# Altium schematic sheet 04-1 m8 power.SchDoc
size A3; SheetNumber: 5; SheetTotal: 16
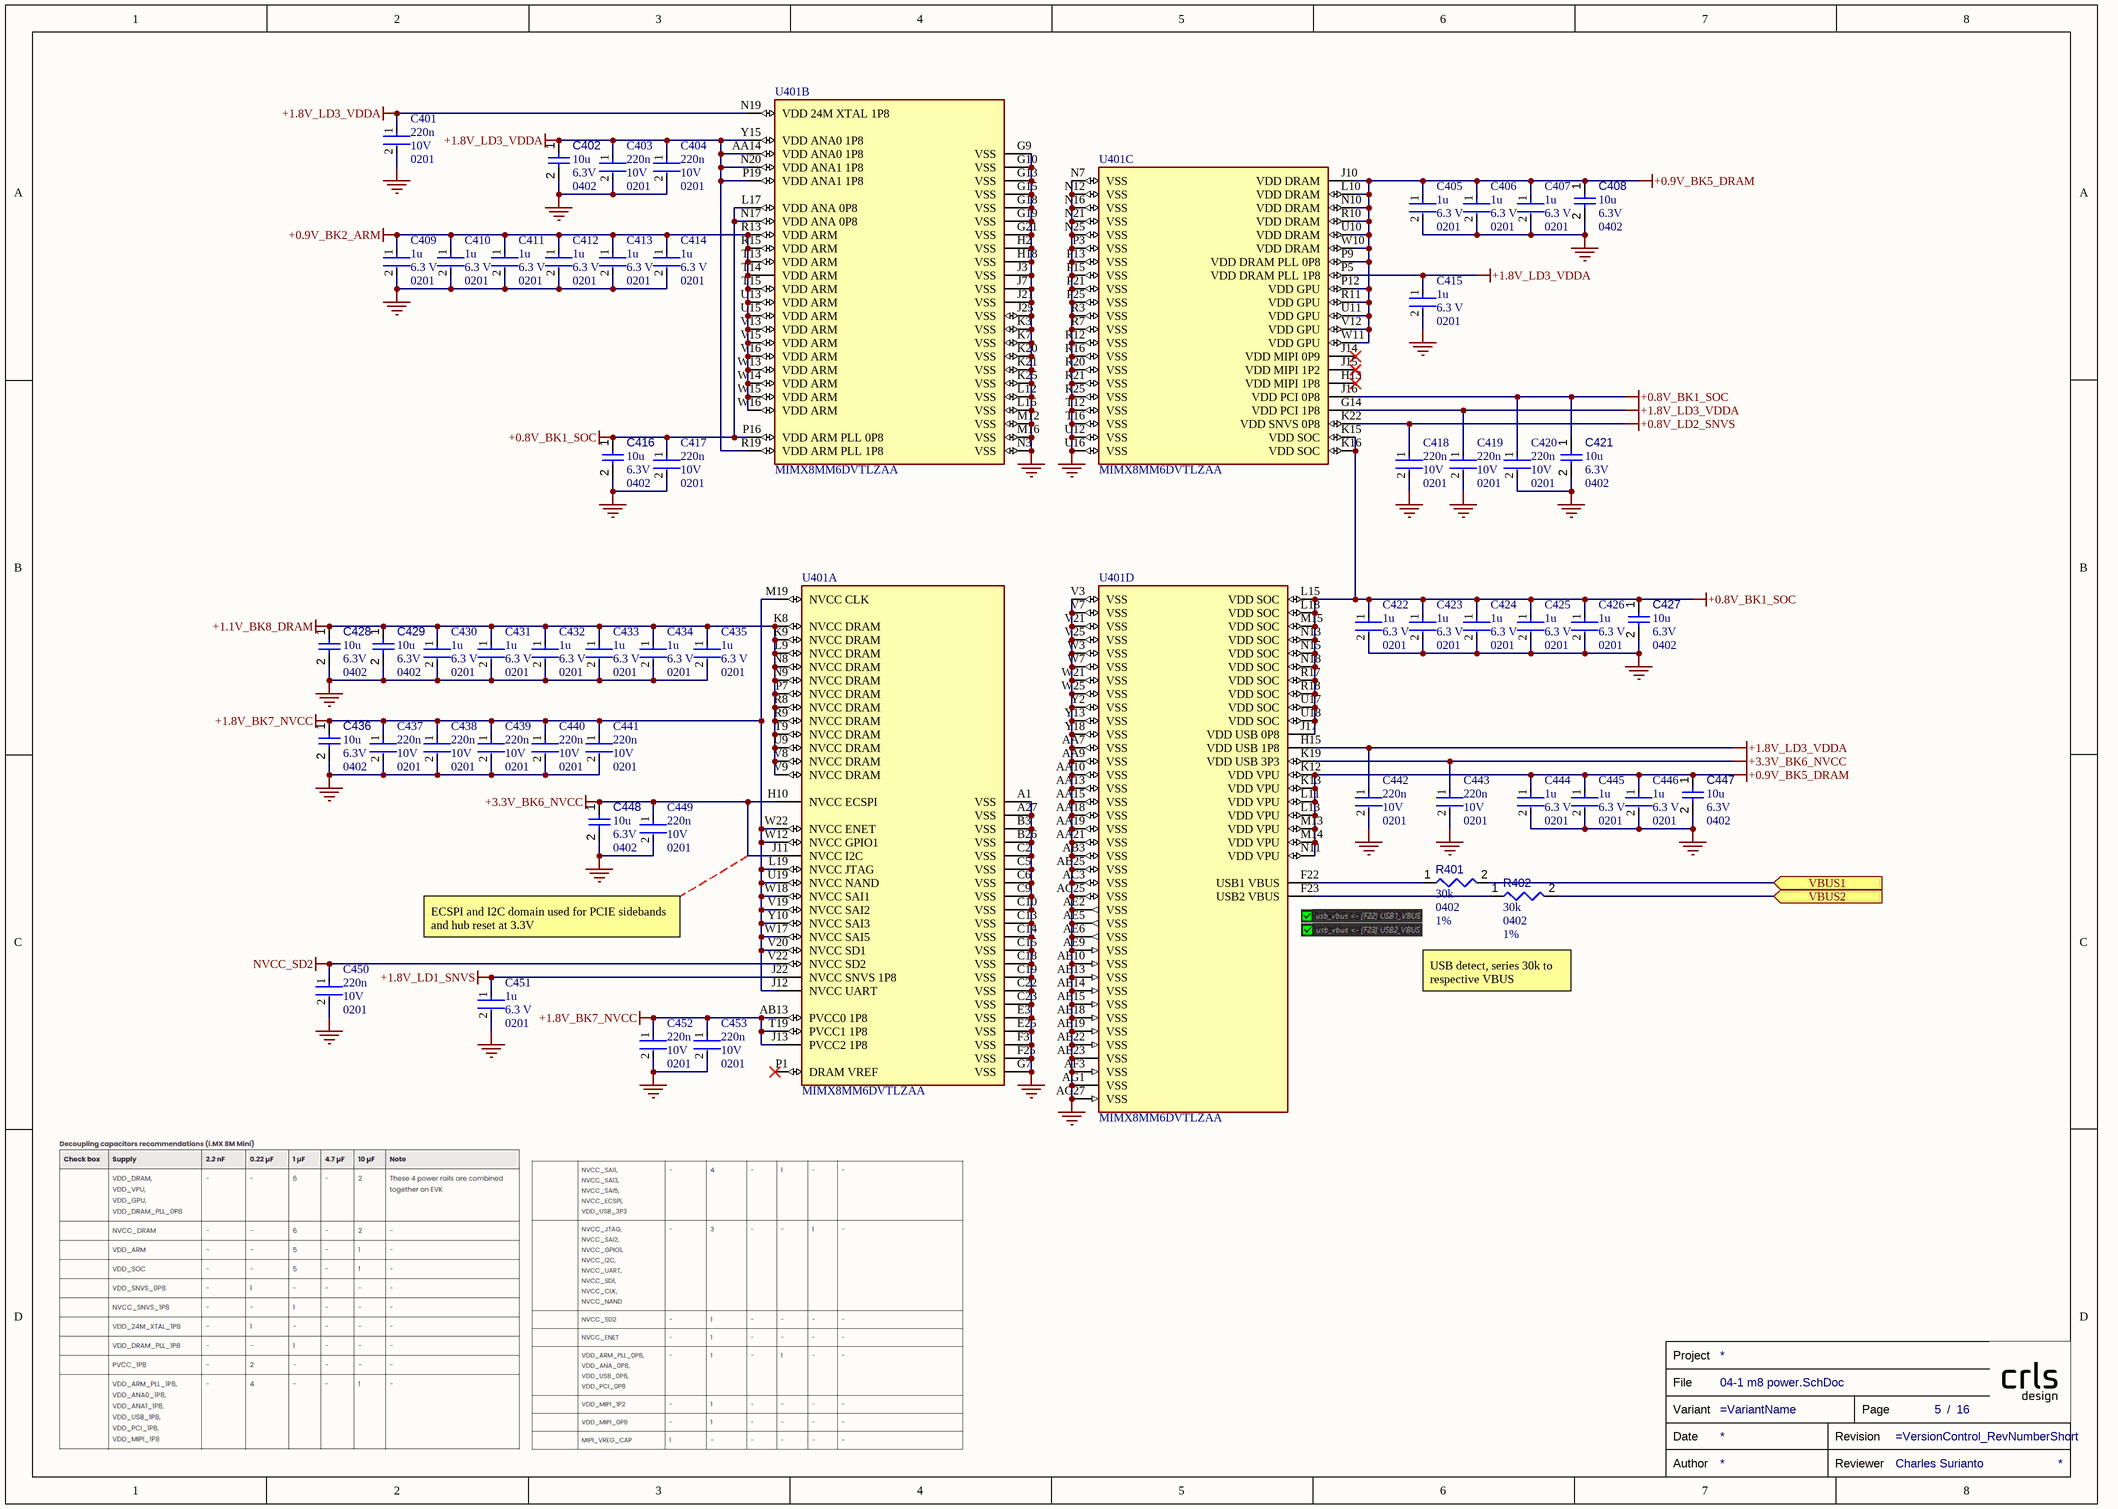
[diagram p0: 04-1 m8 power.SchDoc]

## Parts
C401  Case/Package: 0201  Voltage: 10V  Capacitance: 220n  [FP-0201-L_0_6_0_03-W_0_3-MFG]  (hidden comment: LMK063BJ224MP-F)
C402  value 10u  Case/Package: 0402  Voltage Rating: 6.3V  [CAPC0402(1005)60_L]  (hidden comment: Capacitors,0402,10u,6.3V)
C403  Case/Package: 0201  Voltage: 10V  Capacitance: 220n  [FP-0201-L_0_6_0_03-W_0_3-MFG]  (hidden comment: LMK063BJ224MP-F)
C404  Case/Package: 0201  Voltage: 10V  Capacitance: 220n  [FP-0201-L_0_6_0_03-W_0_3-MFG]  (hidden comment: LMK063BJ224MP-F)
C405  Package: 0201  Capacitance: 1u  Voltage Rating: 6.3 V  [FP-CC0201-BA-MFG]  (hidden comment: CC0201MRX5R5BB105)
C406  Package: 0201  Capacitance: 1u  Voltage Rating: 6.3 V  [FP-CC0201-BA-MFG]  (hidden comment: CC0201MRX5R5BB105)
C407  Package: 0201  Capacitance: 1u  Voltage Rating: 6.3 V  [FP-CC0201-BA-MFG]  (hidden comment: CC0201MRX5R5BB105)
C408  value 10u  Case/Package: 0402  Voltage Rating: 6.3V  [CAPC0402(1005)60_L]  (hidden comment: Capacitors,0402,10u,6.3V)
C409  Package: 0201  Capacitance: 1u  Voltage Rating: 6.3 V  [FP-CC0201-BA-MFG]  (hidden comment: CC0201MRX5R5BB105)
C410  Package: 0201  Capacitance: 1u  Voltage Rating: 6.3 V  [FP-CC0201-BA-MFG]  (hidden comment: CC0201MRX5R5BB105)
C411  Package: 0201  Capacitance: 1u  Voltage Rating: 6.3 V  [FP-CC0201-BA-MFG]  (hidden comment: CC0201MRX5R5BB105)
C412  Package: 0201  Capacitance: 1u  Voltage Rating: 6.3 V  [FP-CC0201-BA-MFG]  (hidden comment: CC0201MRX5R5BB105)
C413  Package: 0201  Capacitance: 1u  Voltage Rating: 6.3 V  [FP-CC0201-BA-MFG]  (hidden comment: CC0201MRX5R5BB105)
C414  Package: 0201  Capacitance: 1u  Voltage Rating: 6.3 V  [FP-CC0201-BA-MFG]  (hidden comment: CC0201MRX5R5BB105)
C415  Package: 0201  Capacitance: 1u  Voltage Rating: 6.3 V  [FP-CC0201-BA-MFG]  (hidden comment: CC0201MRX5R5BB105)
C416  value 10u  Case/Package: 0402  Voltage Rating: 6.3V  [CAPC0402(1005)60_L]  (hidden comment: Capacitors,0402,10u,6.3V)
C417  Case/Package: 0201  Voltage: 10V  Capacitance: 220n  [FP-0201-L_0_6_0_03-W_0_3-MFG]  (hidden comment: LMK063BJ224MP-F)
C418  Case/Package: 0201  Voltage: 10V  Capacitance: 220n  [FP-0201-L_0_6_0_03-W_0_3-MFG]  (hidden comment: LMK063BJ224MP-F)
C419  Case/Package: 0201  Voltage: 10V  Capacitance: 220n  [FP-0201-L_0_6_0_03-W_0_3-MFG]  (hidden comment: LMK063BJ224MP-F)
C420  Case/Package: 0201  Voltage: 10V  Capacitance: 220n  [FP-0201-L_0_6_0_03-W_0_3-MFG]  (hidden comment: LMK063BJ224MP-F)
C421  value 10u  Case/Package: 0402  Voltage Rating: 6.3V  [CAPC0402(1005)60_L]  (hidden comment: Capacitors,0402,10u,6.3V)
C422  Package: 0201  Capacitance: 1u  Voltage Rating: 6.3 V  [FP-CC0201-BA-MFG]  (hidden comment: CC0201MRX5R5BB105)
C423  Package: 0201  Capacitance: 1u  Voltage Rating: 6.3 V  [FP-CC0201-BA-MFG]  (hidden comment: CC0201MRX5R5BB105)
C424  Package: 0201  Capacitance: 1u  Voltage Rating: 6.3 V  [FP-CC0201-BA-MFG]  (hidden comment: CC0201MRX5R5BB105)
C425  Package: 0201  Capacitance: 1u  Voltage Rating: 6.3 V  [FP-CC0201-BA-MFG]  (hidden comment: CC0201MRX5R5BB105)
C426  Package: 0201  Capacitance: 1u  Voltage Rating: 6.3 V  [FP-CC0201-BA-MFG]  (hidden comment: CC0201MRX5R5BB105)
C427  value 10u  Case/Package: 0402  Voltage Rating: 6.3V  [CAPC0402(1005)60_L]  (hidden comment: Capacitors,0402,10u,6.3V)
C428  value 10u  Case/Package: 0402  Voltage Rating: 6.3V  [CAPC0402(1005)60_L]  (hidden comment: Capacitors,0402,10u,6.3V)
C429  value 10u  Case/Package: 0402  Voltage Rating: 6.3V  [CAPC0402(1005)60_L]  (hidden comment: Capacitors,0402,10u,6.3V)
C430  Package: 0201  Capacitance: 1u  Voltage Rating: 6.3 V  [FP-CC0201-BA-MFG]  (hidden comment: CC0201MRX5R5BB105)
C431  Package: 0201  Capacitance: 1u  Voltage Rating: 6.3 V  [FP-CC0201-BA-MFG]  (hidden comment: CC0201MRX5R5BB105)
C432  Package: 0201  Capacitance: 1u  Voltage Rating: 6.3 V  [FP-CC0201-BA-MFG]  (hidden comment: CC0201MRX5R5BB105)
C433  Package: 0201  Capacitance: 1u  Voltage Rating: 6.3 V  [FP-CC0201-BA-MFG]  (hidden comment: CC0201MRX5R5BB105)
C434  Package: 0201  Capacitance: 1u  Voltage Rating: 6.3 V  [FP-CC0201-BA-MFG]  (hidden comment: CC0201MRX5R5BB105)
C435  Package: 0201  Capacitance: 1u  Voltage Rating: 6.3 V  [FP-CC0201-BA-MFG]  (hidden comment: CC0201MRX5R5BB105)
C436  value 10u  Case/Package: 0402  Voltage Rating: 6.3V  [CAPC0402(1005)60_L]  (hidden comment: Capacitors,0402,10u,6.3V)
C437  Case/Package: 0201  Voltage: 10V  Capacitance: 220n  [FP-0201-L_0_6_0_03-W_0_3-MFG]  (hidden comment: LMK063BJ224MP-F)
C438  Case/Package: 0201  Voltage: 10V  Capacitance: 220n  [FP-0201-L_0_6_0_03-W_0_3-MFG]  (hidden comment: LMK063BJ224MP-F)
C439  Case/Package: 0201  Voltage: 10V  Capacitance: 220n  [FP-0201-L_0_6_0_03-W_0_3-MFG]  (hidden comment: LMK063BJ224MP-F)
C440  Case/Package: 0201  Voltage: 10V  Capacitance: 220n  [FP-0201-L_0_6_0_03-W_0_3-MFG]  (hidden comment: LMK063BJ224MP-F)
C441  Case/Package: 0201  Voltage: 10V  Capacitance: 220n  [FP-0201-L_0_6_0_03-W_0_3-MFG]  (hidden comment: LMK063BJ224MP-F)
C442  Case/Package: 0201  Voltage: 10V  Capacitance: 220n  [FP-0201-L_0_6_0_03-W_0_3-MFG]  (hidden comment: LMK063BJ224MP-F)
C443  Case/Package: 0201  Voltage: 10V  Capacitance: 220n  [FP-0201-L_0_6_0_03-W_0_3-MFG]  (hidden comment: LMK063BJ224MP-F)
C444  Package: 0201  Capacitance: 1u  Voltage Rating: 6.3 V  [FP-CC0201-BA-MFG]  (hidden comment: CC0201MRX5R5BB105)
C445  Package: 0201  Capacitance: 1u  Voltage Rating: 6.3 V  [FP-CC0201-BA-MFG]  (hidden comment: CC0201MRX5R5BB105)
C446  Package: 0201  Capacitance: 1u  Voltage Rating: 6.3 V  [FP-CC0201-BA-MFG]  (hidden comment: CC0201MRX5R5BB105)
C447  value 10u  Case/Package: 0402  Voltage Rating: 6.3V  [CAPC0402(1005)60_L]  (hidden comment: Capacitors,0402,10u,6.3V)
C448  value 10u  Case/Package: 0402  Voltage Rating: 6.3V  [CAPC0402(1005)60_L]  (hidden comment: Capacitors,0402,10u,6.3V)
C449  Case/Package: 0201  Voltage: 10V  Capacitance: 220n  [FP-0201-L_0_6_0_03-W_0_3-MFG]  (hidden comment: LMK063BJ224MP-F)
C450  Case/Package: 0201  Voltage: 10V  Capacitance: 220n  [FP-0201-L_0_6_0_03-W_0_3-MFG]  (hidden comment: LMK063BJ224MP-F)
C451  Package: 0201  Capacitance: 1u  Voltage Rating: 6.3 V  [FP-CC0201-BA-MFG]  (hidden comment: CC0201MRX5R5BB105)
C452  Case/Package: 0201  Voltage: 10V  Capacitance: 220n  [FP-0201-L_0_6_0_03-W_0_3-MFG]  (hidden comment: LMK063BJ224MP-F)
C453  Case/Package: 0201  Voltage: 10V  Capacitance: 220n  [FP-0201-L_0_6_0_03-W_0_3-MFG]  (hidden comment: LMK063BJ224MP-F)
R401  value 30k  Case/Package: 0402  Tolerance: 1%  [RESC0402(1005)_L]  (hidden comment: Resistors,0402,1%,30k)
R402  value 30k  Case/Package: 0402  Tolerance: 1%  [RESC0402(1005)_L]  (hidden comment: Resistors,0402,1%,30k)
TB?  Reviewer: Charles Surianto  (hidden comment: TITLE_BLOCK)  (graphical)
U401  MIMX8MM6DVTLZAA  [FP-SOT1967-2-IPC_A]  (parts A,B,C,D of 11)

## Ports
VBUS1 (in), VBUS2 (in)

## Nets
+0.8V_BK1_SOC: C416.1 C417.1 C420.1 C421.1 C422.1 C423.1 C424.1 C425.1 C426.1 C427.1 U401.J16(VDD_PCI_0P8) U401.J17(VDD_USB_0P8) U401.K15(VDD_SOC) U401.K16(VDD_SOC) U401.L15(VDD_SOC) U401.L17(VDD_ANA_0P8) U401.L18(VDD_SOC) U401.M15(VDD_SOC) U401.N13(VDD_SOC) U401.N15(VDD_SOC) U401.N17(VDD_ANA_0P8) U401.N18(VDD_SOC) U401.P16(VDD_ARM_PLL_0P8) U401.R17(VDD_SOC) U401.R18(VDD_SOC) U401.U17(VDD_SOC) U401.U18(VDD_SOC)
+0.8V_LD2_SNVS: C418.1 U401.K22(VDD_SNVS_0P8)
+0.9V_BK2_ARM: C409.1 C410.1 C411.1 C412.1 C413.1 C414.1 U401.R13(VDD_ARM) U401.R15(VDD_ARM) U401.T13(VDD_ARM) U401.T14(VDD_ARM) U401.T15(VDD_ARM) U401.U13(VDD_ARM) U401.U15(VDD_ARM) U401.V13(VDD_ARM) U401.V15(VDD_ARM) U401.V16(VDD_ARM) U401.W13(VDD_ARM) U401.W14(VDD_ARM) U401.W15(VDD_ARM) U401.W16(VDD_ARM)
+0.9V_BK5_DRAM: C405.1 C406.1 C407.1 C408.1 C444.1 C445.1 C446.1 C447.1 U401.J10(VDD_DRAM) U401.K12(VDD_VPU) U401.K13(VDD_VPU) U401.L10(VDD_DRAM) U401.L11(VDD_VPU) U401.L13(VDD_VPU) U401.M13(VDD_VPU) U401.M14(VDD_VPU) U401.N10(VDD_DRAM) U401.N11(VDD_VPU) U401.P9(VDD_DRAM_PLL_0P8) U401.P12(VDD_GPU) U401.R10(VDD_DRAM) U401.R11(VDD_GPU) U401.U10(VDD_DRAM) U401.U11(VDD_GPU) U401.V12(VDD_GPU) U401.W10(VDD_DRAM) U401.W11(VDD_GPU)
+1.1V_BK8_DRAM: C428.1 C429.1 C430.1 C431.1 C432.1 C433.1 C434.1 C435.1 U401.K8(NVCC_DRAM) U401.K9(NVCC_DRAM) U401.L9(NVCC_DRAM) U401.N8(NVCC_DRAM) U401.N9(NVCC_DRAM) U401.P7(NVCC_DRAM) U401.R8(NVCC_DRAM) U401.R9(NVCC_DRAM) U401.T9(NVCC_DRAM) U401.U9(NVCC_DRAM) U401.V8(NVCC_DRAM) U401.V9(NVCC_DRAM)
+1.8V_BK7_NVCC: C436.1 C437.1 C438.1 C439.1 C440.1 C441.1 C452.1 C453.1 U401.AB13(PVCC0_1P8) U401.J12(NVCC_UART) U401.J13(PVCC2_1P8) U401.L19(NVCC_JTAG) U401.M19(NVCC_CLK) U401.T19(PVCC1_1P8) U401.U19(NVCC_NAND) U401.V19(NVCC_SAI2) U401.V20(NVCC_SD1) U401.W12(NVCC_GPIO1) U401.W17(NVCC_SAI5) U401.W18(NVCC_SAI1) U401.W22(NVCC_ENET) U401.Y10(NVCC_SAI3)
+1.8V_LD1_SNVS: C451.1 U401.J22(NVCC_SNVS_1P8)
+1.8V_LD3_VDDA: C401.1 C402.1 C403.1 C404.1 C415.1 C419.1 C442.1 U401.AA14(VDD_ANA0_1P8) U401.G14(VDD_PCI_1P8) U401.H15(VDD_USB_1P8) U401.N19(VDD_24M_XTAL_1P8) U401.N20(VDD_ANA1_1P8) U401.P5(VDD_DRAM_PLL_1P8) U401.P19(VDD_ANA1_1P8) U401.R19(VDD_ARM_PLL_1P8) U401.Y15(VDD_ANA0_1P8)
+3.3V_BK6_NVCC: C443.1 C448.1 C449.1 U401.H10(NVCC_ECSPI) U401.J11(NVCC_I2C) U401.K19(VDD_USB_3P3)
GND: C401.2 C402.2 C403.2 C404.2 C405.2 C406.2 C407.2 C408.2 C409.2 C410.2 C411.2 C412.2 C413.2 C414.2 C415.2 C416.2 C417.2 C418.2 C419.2 C420.2 C421.2 C422.2 C423.2 C424.2 C425.2 C426.2 C427.2 C428.2 C429.2 C430.2 C431.2 C432.2 C433.2 C434.2 C435.2 C436.2 C437.2 C438.2 C439.2 C440.2 C441.2 C442.2 C443.2 C444.2 C445.2 C446.2 C447.2 C448.2 C449.2 C450.2 C451.2 C452.2 C453.2 U401.A1(VSS) U401.A27(VSS) U401.AA7(VSS) U401.AA9(VSS) U401.AA10(VSS) U401.AA13(VSS) U401.AA15(VSS) U401.AA18(VSS) U401.AA19(VSS) U401.AA21(VSS) U401.AB3(VSS) U401.AB25(VSS) U401.AC3(VSS) U401.AC25(VSS) U401.AE2(VSS) U401.AE5(VSS) U401.AE6(VSS) U401.AE9(VSS) U401.AE10(VSS) U401.AE13(VSS) U401.AE14(VSS) U401.AE15(VSS) U401.AE18(VSS) U401.AE19(VSS) U401.AE22(VSS) U401.AE23(VSS) U401.AF3(VSS) U401.AG1(VSS) U401.AG27(VSS) U401.B3(VSS) U401.B26(VSS) U401.C2(VSS) U401.C5(VSS) U401.C6(VSS) U401.C9(VSS) U401.C10(VSS) U401.C13(VSS) U401.C14(VSS) U401.C15(VSS) U401.C18(VSS) U401.C19(VSS) U401.C22(VSS) U401.C23(VSS) U401.E3(VSS) U401.E25(VSS) U401.F3(VSS) U401.F25(VSS) U401.G7(VSS) U401.G9(VSS) U401.G10(VSS) U401.G13(VSS) U401.G15(VSS) U401.G18(VSS) U401.G19(VSS) U401.G21(VSS) U401.H2(VSS) U401.H18(VSS) U401.J3(VSS) U401.J7(VSS) U401.J21(VSS) U401.J25(VSS) U401.K3(VSS) U401.K7(VSS) U401.K20(VSS) U401.K21(VSS) U401.K25(VSS) U401.L12(VSS) U401.L16(VSS) U401.M12(VSS) U401.M16(VSS) U401.N3(VSS) U401.N7(VSS) U401.N12(VSS) U401.N16(VSS) U401.N21(VSS) U401.N25(VSS) U401.P3(VSS) U401.P13(VSS) U401.P15(VSS) U401.P21(VSS) U401.P25(VSS) U401.R3(VSS) U401.R7(VSS) U401.R12(VSS) U401.R16(VSS) U401.R20(VSS) U401.R21(VSS) U401.R25(VSS) U401.T12(VSS) U401.T16(VSS) U401.U12(VSS) U401.U16(VSS) U401.V3(VSS) U401.V7(VSS) U401.V21(VSS) U401.V25(VSS) U401.W3(VSS) U401.W7(VSS) U401.W21(VSS) U401.W25(VSS) U401.Y2(VSS) U401.Y13(VSS) U401.Y18(VSS)
NVCC_SD2: C450.1 U401.V22(NVCC_SD2)
VBUS1: R401.2 ; port VBUS1
VBUS2: R402.2 ; port VBUS2
NetR401_1: R401.1 U401.F22(USB1_VBUS)
NetR402_1: R402.1 U401.F23(USB2_VBUS)

Not connected (* = marked no-connect by the designer): U401 H13(VDD_MIPI_1P8)* J14(VDD_MIPI_0P9)* J15(VDD_MIPI_1P2)* P1(DRAM_VREF)*

## Notes on the sheet
- ECSPI and I2C domain used for PCIE sidebands and hub reset at 3.3V
- USB detect, series 30k to respective VBUS
- (in symbol TITLE_BLOCK) Project; File; Variant; Page; /; Date; Revision; Author; Reviewer

## Library data of the parts
C401 C403 C404 C417-C420 C437-C443 C449 C450 C452 C453 = CMP-14477-003517-2: None; Dielectric: X5R; Tolerance: 20%; Min Operating Temperature: -55°C; Halogen Free: Halogen Free; Termination: SMD/SMT; Case Code (Imperial): 0201; Thickness: 0.013inch; Width: 0.012inch; Packaging: Tape and Reel; Case Code (Metric): 0603; Height: 0.3mm; Resistor Type: Ceramic; Depth: 0.3mm; Mount: Surface Mount; Package Quantity: 15000; Voltage Rating (DC): 10V; Max Operating Temperature: 85°C; Radiation Hardening: No; RoHS Compliant: Yes; Voltage Rating: 10V; Series: M; Construction: Flat; Length: 0.6mm
C402 C408 C416 C421 C427-C429 C436 C447 C448 = Capacitors: Capacitor; Component Type: Capacitors
C405-C407 C409-C415 C422-C426 C430-C435 C444-C446 C451 = CMP-03422-000660-2: CAP CER 1UF 6.3V X5R 0201; Manufacturer: Yageo; Tolerance: 0.2; Material: Ceramic; Temperature Coefficient: 15%; Category: Cap; Digikey Description: CAP CER 1UF 6.3V X5R 0201; Temperature: -55°C to +85°C; Temperature Range High: +85°C; ComponentLink2Description: Datasheet; Lead Free: Yes; Height: 0.33mm; Temperature Range Low: -55°C; Temperature Characteristic: X5R; Device Class L1: Passive Components; Footprint Url: http://www.yageo.com/exep/pages/download/literatures/UPY-C_GEN_24.pdf; Value: 1 uF; Octopart: https://octopart.com/cc0201mrx5r5bb105-yageo-33242268; Manufacturer Part Number: CC0201MRX5R5BB105; Automotive: No; Mouser Description: Multilayer Ceramic Capacitors MLCC - SMD/SMT 1.0uF 6.3V X5R 20%; Device Class L3: Ceramic Capacitors; ComponentLink2URL: http://www.yageo.com/documents/recent/UPY-GPHC_X5R_4V-to-50V_25.pdf; RoHS: TRUE; Ipc Land Pattern Name: CAPC6030X30; Device Class L2: Capacitors
R401 R402 = Resistors: Resistor; Component Type: Resistors
U401 = CMP-10096-000012-1: IC MPU I.MX 8M MINI QUAD BGA; RoHS Compliant: Yes
TB? = TITLE_BLOCK: Review Date: *